# Altium schematic sheet Encoder.SchDoc: Encoders
size Letter; Engineer: Nathan Petersen; DocumentNumber: 18; Revision: v1.2; SheetNumber: 18; SheetTotal: 23
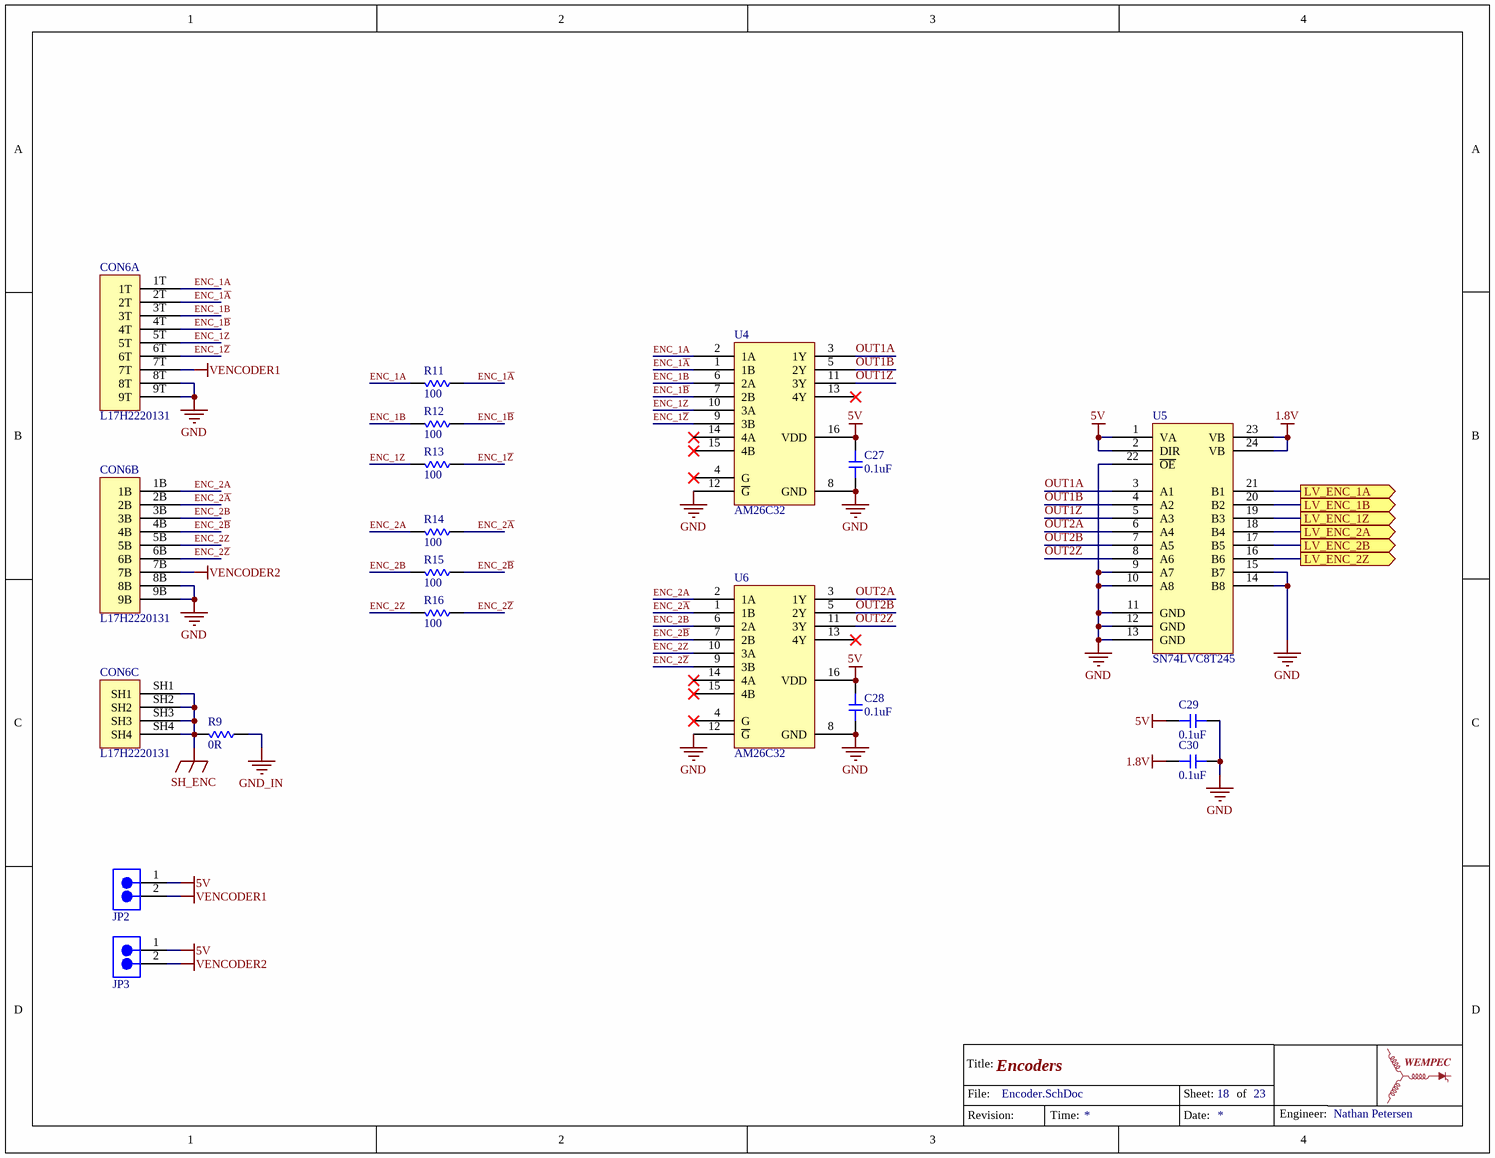
[diagram p0: Encoder.SchDoc]

## Parts
C27  value 0.1uF  [0603-CAP]  (hidden comment: Capacitor)
C28  value 0.1uF  [0603-CAP]  (hidden comment: Capacitor)
C29  value 0.1uF  [0603-CAP]  (hidden comment: Capacitor)
C30  value 0.1uF  [0603-CAP]  (hidden comment: Capacitor)
CON6  L17H2220131  [L17H2220131]  (parts A,B,C of 3)
JP2  Jumper2  [PIN_HEADER_1x2]  (value not drawn)
JP3  Jumper2  [PIN_HEADER_1x2]  (value not drawn)
R9  value 0R  [1206-RES]  (hidden comment: Resistor)
R11  value 100  [0603-RES]  (hidden comment: Resistor)
R12  value 100  [0603-RES]  (hidden comment: Resistor)
R13  value 100  [0603-RES]  (hidden comment: Resistor)
R14  value 100  [0603-RES]  (hidden comment: Resistor)
R15  value 100  [0603-RES]  (hidden comment: Resistor)
R16  value 100  [0603-RES]  (hidden comment: Resistor)
U4  AM26C32  [TSOP65P640X120-16N]
U5  SN74LVC8T245  [TSOP65P640X120-24N]
U6  AM26C32  [TSOP65P640X120-16N]

## Ports
LV_ENC_1A (out), LV_ENC_1B (out), LV_ENC_1Z (out), LV_ENC_2A (out), LV_ENC_2B (out), LV_ENC_2Z (out)

## Nets
1.8V: C30.1 U5.23(VB) U5.24(VB)
5V: C27.2 C28.2 C29.1 JP2.1 JP3.1 U4.16(VDD) U5.1(VA) U5.2(DIR) U6.16(VDD)
GND: C27.1 C28.1 C29.2 C30.2 CON6.8B CON6.8T CON6.9B CON6.9T U4.8(GND) U4.12(~{G}) U5.9(A7) U5.10(A8) U5.11(GND) U5.12(GND) U5.13(GND) U5.14(B8) U5.15(B7) U5.22(~{OE}) U6.8(GND) U6.12(~{G})
GND_IN: R9.1
SH_ENC: CON6.SH1 CON6.SH2 CON6.SH3 CON6.SH4 R9.2
VENCODER1: CON6.7T JP2.2
VENCODER2: CON6.7B JP3.2
ENC_1A: CON6.1T R11.2 U4.2(1A)
ENC_1~{A}: CON6.2T R11.1 U4.1(1B)
ENC_1B: CON6.3T R12.2 U4.6(2A)
ENC_1~{B}: CON6.4T R12.1 U4.7(2B)
ENC_1Z: CON6.5T R13.2 U4.10(3A)
ENC_1~{Z}: CON6.6T R13.1 U4.9(3B)
ENC_2A: CON6.1B R14.2 U6.2(1A)
ENC_2~{A}: CON6.2B R14.1 U6.1(1B)
ENC_2B: CON6.3B R15.2 U6.6(2A)
ENC_2~{B}: CON6.4B R15.1 U6.7(2B)
ENC_2Z: CON6.5B R16.2 U6.10(3A)
ENC_2~{Z}: CON6.6B R16.1 U6.9(3B)
LV_ENC_1A: U5.21(B1) ; port LV_ENC_1A
LV_ENC_1B: U5.20(B2) ; port LV_ENC_1B
LV_ENC_1Z: U5.19(B3) ; port LV_ENC_1Z
LV_ENC_2A: U5.18(B4) ; port LV_ENC_2A
LV_ENC_2B: U5.17(B5) ; port LV_ENC_2B
LV_ENC_2Z: U5.16(B6) ; port LV_ENC_2Z
OUT1A: U4.3(1Y) U5.3(A1)
OUT1B: U4.5(2Y) U5.4(A2)
OUT1Z: U4.11(3Y) U5.5(A3)
OUT2A: U5.6(A4) U6.3(1Y)
OUT2B: U5.7(A5) U6.5(2Y)
OUT2Z: U5.8(A6) U6.11(3Y)

Not connected (* = marked no-connect by the designer): U4 4(G)* 13(4Y)* 14(4A)* 15(4B)*; U6 4(G)* 13(4Y)* 14(4A)* 15(4B)*

## Notes on the sheet
- Title:
- File:
- Sheet:
- of
- Revision:
- Time:
- Date:
- Engineer:

## Library data of the parts
CON6 = L17H2220131: CONN D-SUB RCPT 9POS R/A SLDR; Supplier 1: Digi-Key; Supplier Part Number 1: L17H2220131-ND
U4 U6 = AM26C32: IC RCVR RS422 QUAD DIFF 16TSSOP; Supplier 1: Digi-Key; Supplier Part Number 1: 296-30088-1-ND
U5 = SN74LVC8T245PWR: IC BUS TRANSCVR 8BIT 24TSSOP; Supplier 1: Digi-Key; Supplier Part Number 1: 296-18593-1-ND
C27-C30 = Capacitor: Supplier 1: Digi-Key; Supplier Part Number 1: 1276-1012-6-ND
JP2 JP3 = Jumper2: Supplier 1: Digi-Key; Supplier Part Number 1: 732-5315-ND
R9 R11-R16 = Resistor: Supplier 1: Digi-Key
  R9: Supplier Part Number 1: 311-0.0ERCT-ND
  R11-R16: Supplier Part Number 1: YAG3561DKR-ND